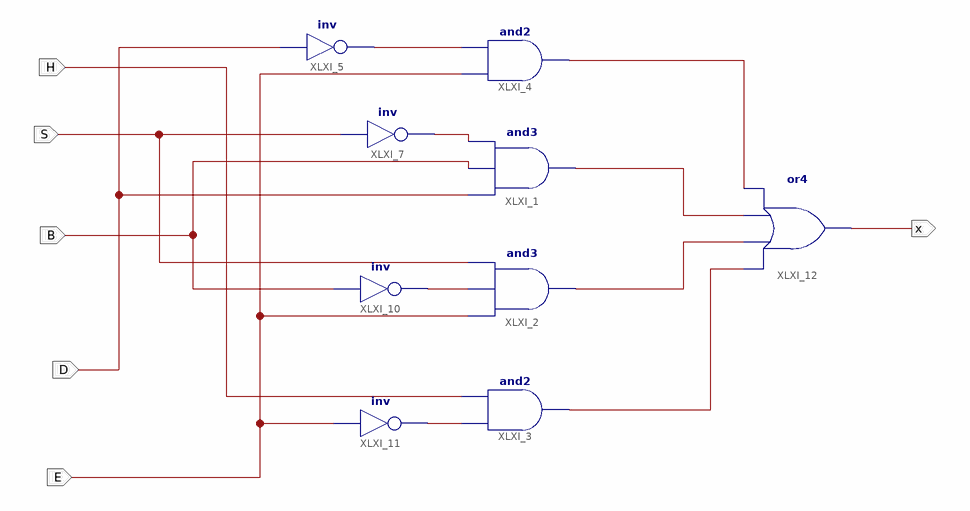
[diagram p0: schematic sheet 1]
// Xilinx ISE schematic HalfAdder.sch (spartan6) as structural Verilog: 9 symbols, 6 ports
module HalfAdder (
  input  D,
  input  H,
  input  E,
  input  S,
  input  B,
  output x
);

  wire XLXN_1, XLXN_2, XLXN_3, XLXN_4, XLXN_21, XLXN_24, XLXN_25, XLXN_26;

  and XLXI_1 (XLXN_26, D, B, XLXN_3);
  and XLXI_2 (XLXN_24, E, XLXN_2, S);
  and XLXI_3 (XLXN_25, XLXN_1, H);
  and XLXI_4 (XLXN_21, E, XLXN_4);
  not XLXI_5 (XLXN_4, D);
  not XLXI_10 (XLXN_2, B);
  not XLXI_7 (XLXN_3, S);
  not XLXI_11 (XLXN_1, E);
  or XLXI_12 (x, XLXN_25, XLXN_24, XLXN_26, XLXN_21);
endmodule
